# Altium schematic sheet 基于NB-IOT光照计设计电路.SchDoc
size A3
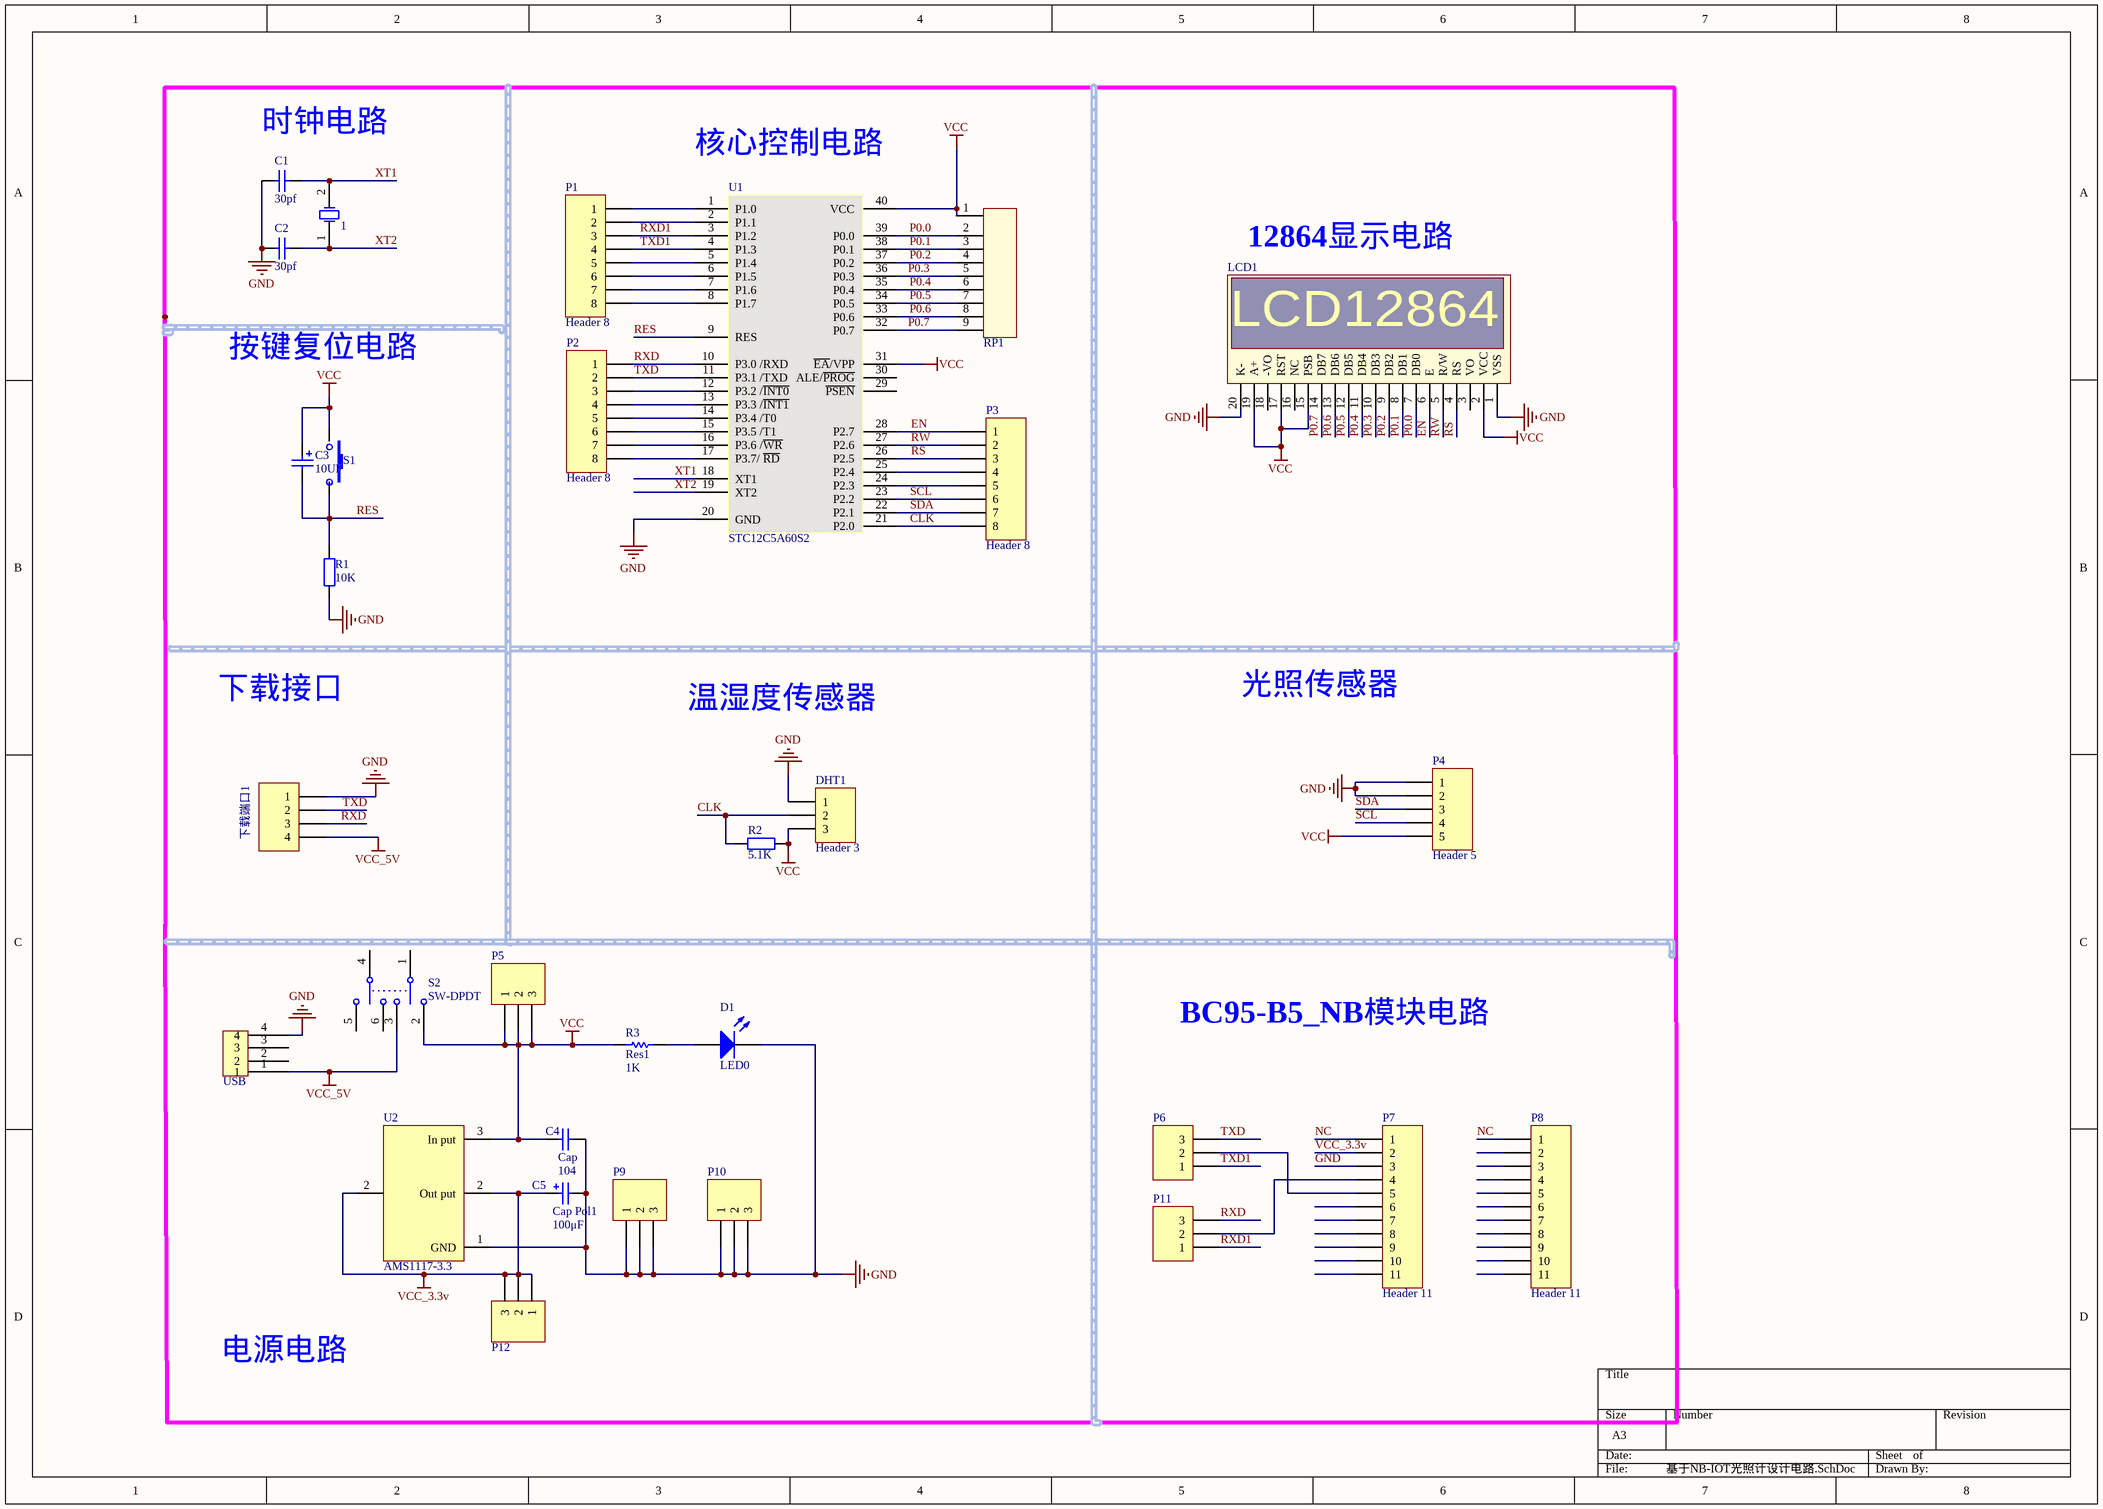
[diagram p0: 基于NB-IOT光照计设计电路.SchDoc]

## Parts
1  XTAL  [4.直插晶振]  (value not drawn)
C1  30pf  [2.瓷片电容]
C2  30pf  [2.瓷片电容]
C3  10UF  [C100A]
C4  Cap  value 104  [CAP]
C5  Cap Pol1  value 100μF  [Cap+]
D1  LED0  [LED-2]
DHT1  Header 3  [HDR1X3]
LCD1  (no value)  [LCD12864]
P1  Header 8  [HDR1X8]
P2  Header 8  [HDR1X8]
P3  Header 8  [HDR1X8]
P4  Header 5  [HDR1X5]
P5  (no value)  [HDR1X3]
P6  (no value)  [HDR1X3]
P7  Header 11  [HDR1X11]
P8  Header 11  [HDR1X11]
P9  (no value)  [HDR1X3]
P10  (no value)  [HDR1X3]
P11  (no value)  [HDR1X3]
P12  (no value)  [HDR1X3]
R1  10K  [R-300 1/4W]
R2  5.1K  [R-300 1/4W]
R3  Res1  value 1K  [AXIAL-0.3]
RP1  RESPACK-8  [3.排阻]  (value not drawn)
S1  (no value)  [KEY1]
S2  SW-DPDT  [swichX6]
U1  STC12C5A60S2  [DIP-40]
U2  AMS1117-3.3  [AMS1117]
Usb1  USB  [USB-A]
下载端口1  气体  [HDR1X4]  (value not drawn)

## Nets
GND: C1.1 C2.1 C4.2 C5.2 D1.2(K) DHT1.1 LCD1.1(VSS) LCD1.20(K-) P4.1 P4.2 P7.3 P9.1 P9.2 P9.3 P10.1 P10.2 P10.3 R1.2 U1.20(GND) U2.1(GND) Usb1.4 下载端口1.1
VCC: C3.1 C4.1 DHT1.3 LCD1.2(VCC) LCD1.15(PSB) LCD1.17(RST) LCD1.19(A+) P4.5 P5.1 P5.2 P5.3 R2.1 R3.1 RP1.1 S1.1 S2.2 U1.31(~{EA}/VPP) U1.40(VCC) U2.3(In_put)
VCC_3.3v: C5.1 P7.2 P12.1 P12.2 P12.3 U2.2(Out_put)
VCC_5V: S2.3 Usb1.1 下载端口1.4
CLK: DHT1.2 P3.8 R2.2 U1.21(P2.0)
EN: LCD1.6(E) P3.1 U1.28(P2.7)
NC: P7.1 P8.1
P0.0: LCD1.7(DB0) RP1.2 U1.39(P0.0)
P0.1: LCD1.8(DB1) RP1.3 U1.38(P0.1)
P0.2: LCD1.9(DB2) RP1.4 U1.37(P0.2)
P0.3: LCD1.10(DB3) RP1.5 U1.36(P0.3)
P0.4: LCD1.11(DB4) RP1.6 U1.35(P0.4)
P0.5: LCD1.12(DB5) RP1.7 U1.34(P0.5)
P0.6: LCD1.13(DB6) RP1.8 U1.33(P0.6)
P0.7: LCD1.14(DB7) RP1.9 U1.32(P0.7)
RES: C3.2 R1.1 S1.2 U1.9(RES)
RS: LCD1.4(RS) P3.3 U1.26(P2.5)
RW: LCD1.5(R/W) P3.2 U1.27(P2.6)
RXD: P2.1 P11.3 U1.10(P3.0_/RXD) 下载端口1.3
RXD1: P1.3 P11.1 U1.3(P1.2)
SCL: P3.6 P4.4 U1.23(P2.2)
SDA: P3.7 P4.3 U1.22(P2.1)
TXD: P2.2 P6.3 U1.11(P3.1_/TXD) 下载端口1.2
TXD1: P1.4 P6.1 U1.4(P1.3)
XT1: 1.2(OSC2) C1.2 U1.18(XT1)
XT2: 1.1(OSC1) C2.2 U1.19(XT2)
NetD1_1: D1.1(A) R3.2
NetP1_1: P1.1 U1.1(P1.0)
NetP1_2: P1.2 U1.2(P1.1)
NetP1_5: P1.5 U1.5(P1.4)
NetP1_6: P1.6 U1.6(P1.5)
NetP1_7: P1.7 U1.7(P1.6)
NetP1_8: P1.8 U1.8(P1.7)
NetP2_3: P2.3 U1.12(P3.2_/~{INT0})
NetP2_4: P2.4 U1.13(P3.3_/~{INT1})
NetP2_5: P2.5 U1.14(P3.4_/T0)
NetP2_6: P2.6 U1.15(P3.5_/T1)
NetP2_7: P2.7 U1.16(P3.6_/~{WR})
NetP2_8: P2.8 U1.17(P3.7/_~{RD})
NetP3_4: P3.4 U1.25(P2.4)
NetP3_5: P3.5 U1.24(P2.3)
NetP6_2: P6.2 P7.5
NetP7_4: P7.4 P11.2

Not connected (* = marked no-connect by the designer): LCD1 3(VO) 16(NC) 18(-VO); P7 6 7 8 9 10 11; P8 2 3 4 5 6 7 8 9 10 11; S2 1 4 5(6) 6(5); U1 29(~{PSEN}) 30(ALE/~{PROG}); Usb1 2 3

## Notes on the sheet
- (near C1) 时钟电路
- (near U1) 核心控制电路
- 12864显示电路
- 按键复位电路
- 下载接口
- 温湿度传感器
- 光照传感器
- BC95-B5_NB模块电路
- 电源电路
- (in symbol LCD1) LCD12864

## Library data of the parts
C1 C2 = CAP
C3 = C-100: Value: 10uf
C4 = Cap: Capacitor; Published: 8-Jun-2000; LatestRevisionDate: 17-Jul-2002; LatestRevisionNote: Re-released for DXP Platform.; Publisher: Altium Limited
C5 = Cap Pol1: Polarized Capacitor (Radial); Published: 8-Jun-2000; LatestRevisionDate: 17-Jul-2002; LatestRevisionNote: Re-released for DXP Platform.; Publisher: Altium Limited
D1 = LED0: Typical INFRARED GaAs LED; Published: 8-Jun-2000; LatestRevisionDate: 17-Jul-2002; LatestRevisionNote: Re-released for DXP Platform.; Publisher: Altium Limited
DHT1 P5 P6 P9-P12 = Header 3: Header, 3-Pin; LatestRevisionDate: 17-Jul-2002; LatestRevisionNote: Re-released for DXP Platform.; Publisher: Altium Limited
LCD1 = LCD1
P1-P3 = Header 8: Header, 8-Pin; LatestRevisionDate: 17-Jul-2002; LatestRevisionNote: Re-released for DXP Platform.; Publisher: Altium Limited
P4 = Header 5: Header, 5-Pin; LatestRevisionDate: 17-Jul-2002; LatestRevisionNote: Re-released for DXP Platform.; Publisher: Altium Limited
P7 P8 = Header 11: Header, 11-Pin; LatestRevisionDate: 17-Jul-2002; LatestRevisionNote: Re-released for DXP Platform.; Publisher: Altium Limited
R1 R2 = R1: Value: 1K
R3 = Res1: Resistor; Published: 8-Jun-2000; LatestRevisionDate: 17-Jul-2002; LatestRevisionNote: Re-released for DXP Platform.; Publisher: Altium Limited
S2 = SW-DPDT: Double-Pole, Double-Throw Switch; Published: 24-Mar-1999; LatestRevisionDate: 17-Jul-2002; LatestRevisionNote: Re-released for DXP Platform.; Publisher: Altium Limited
U1 = STC89C52
下载端口1 = Header 4: Header, 4-Pin; LatestRevisionDate: 17-Jul-2002; LatestRevisionNote: Re-released for DXP Platform.; Publisher: Altium Limited